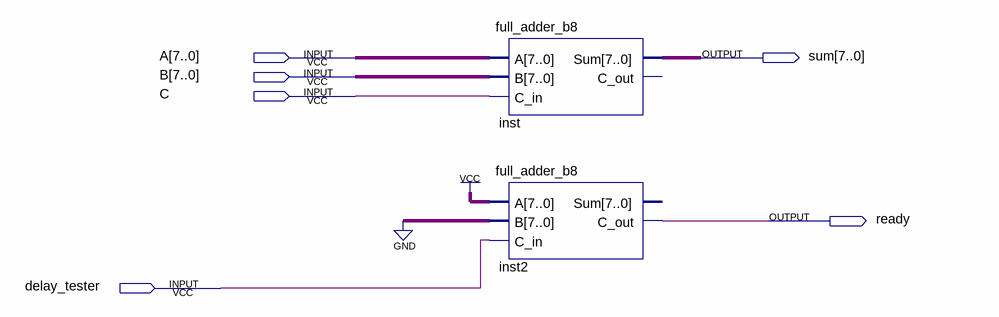
[diagram p0: schematic sheet]
// Quartus schematic delay_test.bdf as structural Verilog: 2 symbols, 6 pins
module delay_test (
  input  [7:0] A,
  input  [7:0] B,
  input  C,
  input  delay_tester,
  output [7:0] sum,
  output ready
);

  full_adder_b8 inst (.A(A), .B(B), .C_in(C), .Sum(sum));  // open: C_out
  full_adder_b8 inst2 (.A({8{1'b1}}), .B({8{1'b0}}), .C_in(delay_tester), .C_out(ready));  // open: Sum
endmodule
